# Altium schematic sheet I2C.SchDoc
size A; DocumentNumber: 9; SheetNumber: 9; SheetTotal: 9
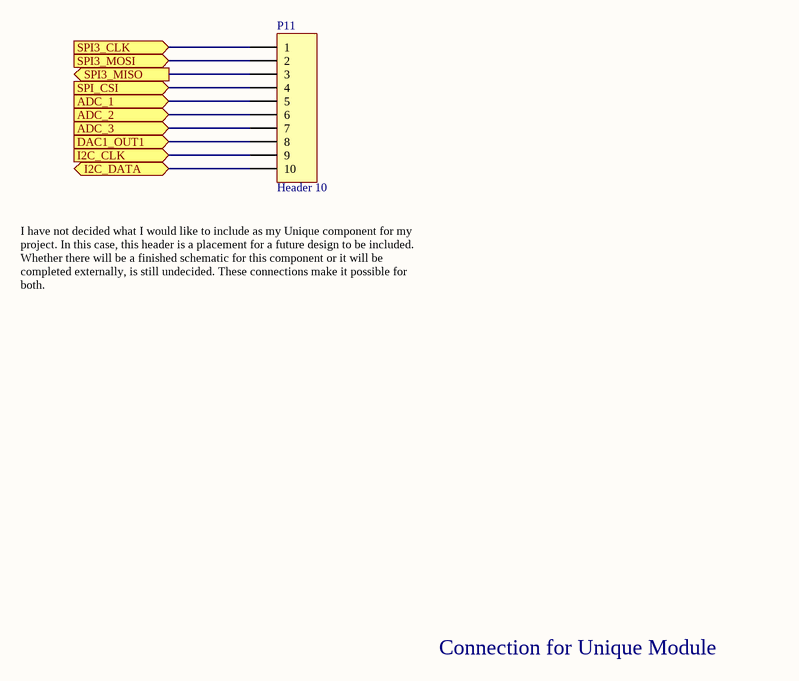
[diagram p0: I2C.SchDoc]

## Parts
P11  Header 10  [HDR1X10]

## Ports
ADC_1 (in), ADC_2 (in), ADC_3 (in), DAC1_OUT1 (in), I2C_CLK (in), I2C_DATA (bidir), SPI3_CLK (in), SPI3_MISO (out), SPI3_MOSI (in), SPI_CSI (in)

## Nets
ADC_1: P11.5 ; port ADC_1
ADC_2: P11.6 ; port ADC_2
ADC_3: P11.7 ; port ADC_3
DAC1_OUT1: P11.8 ; port DAC1_OUT1
I2C_CLK: P11.9 ; port I2C_CLK
I2C_DATA: P11.10 ; port I2C_DATA
SPI3_CLK: P11.1 ; port SPI3_CLK
SPI3_MISO: P11.3 ; port SPI3_MISO
SPI3_MOSI: P11.2 ; port SPI3_MOSI
SPI_CSI: P11.4 ; port SPI_CSI

## Notes on the sheet
- I have not decided what I would like to include as my Unique component for my project. In this case, this header is a placement for a future design to be included. Whether there will be a finished schematic for this component or it will be completed externally, is still undecided. These connections make it possible for both.
- Connection for Unique Module

## Library data of the parts
P11 = Header 10: Header, 10-Pin; LatestRevisionDate: 17-Jul-2002; LatestRevisionNote: Re-released for DXP Platform.; Publisher: Altium Limited